# Altium schematic sheet Sheet2.SchDoc
size A4
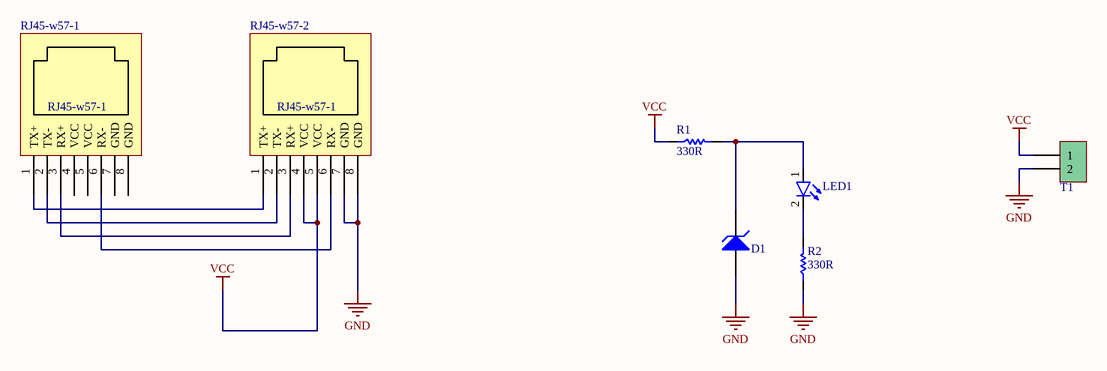
[diagram p0: Sheet2.SchDoc]

## Parts
D1  Diode Zener  [Diode 1W]  (value not drawn)
LED1  Red  [LED-5mm]  (value not drawn)
R1  330R  [RES 1206 (3216X08L)]
R2  330R  [RES 1206 (3216X08L)]
RJ45-w57-1  RJ45-w57-1  [rj45-w57-1]
RJ45-w57-2  RJ45-w57-1  [rj45-w57-1]
T1  Phoenix terminal  [phoenix terminal 2]  (value not drawn)

## Nets
GND: D1.1(A) R2.1 RJ45-w57-2.7(GND) RJ45-w57-2.8(GND) T1.2
VCC: R1.1 RJ45-w57-2.4(VCC) RJ45-w57-2.5(VCC) T1.1
NetD1_2: D1.2(K) LED1.1(A) R1.2
NetLED1_2: LED1.2(K) R2.2
NetRJ45-w57-1_1: RJ45-w57-1.1(TX+) RJ45-w57-2.1(TX+)
NetRJ45-w57-1_2: RJ45-w57-1.2(TX-) RJ45-w57-2.2(TX-)
NetRJ45-w57-1_3: RJ45-w57-1.3(RX+) RJ45-w57-2.3(RX+)
NetRJ45-w57-1_6: RJ45-w57-1.6(RX-) RJ45-w57-2.6(RX-)

Not connected (* = marked no-connect by the designer): RJ45-w57-1 4(VCC) 5(VCC) 7(GND) 8(GND)

## Library data of the parts
D1 = Diode Zener: Zener Diode; Designer: Saeid Jorablo; Company: E.P.I.L; Voltage: 12V; Design Date: 2011/11/02
LED1 = LED: Designer: Saeid Jorablo; Organazation: ControTec; Adding Date: 1387/12/22; Color: Red; Size: SMD 1206
R1 R2 = Resistor: Tolerance: 5%; Power: 1/8 W; Value: 330R
T1 = Phoenix terminal 2: Terminal 2 Pin; Designer: Seyed Mohsen Ghasemain; E-mail: picpars@gmail.com; ComponentLinkURL: www.picpars.com